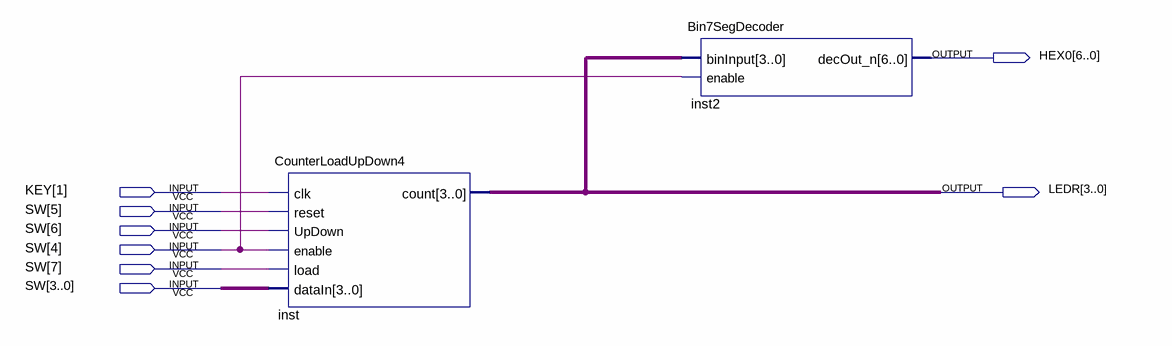
[diagram p0: schematic sheet]
// Quartus schematic CounterLoadUpDown4_bloc.bdf as structural Verilog: 2 symbols, 8 pins
module CounterLoadUpDown4_bloc (
  input  [1:1] KEY,
  input  [7:0] SW,
  output [6:0] HEX0,
  output [3:0] LEDR
);

  CounterLoadUpDown4 inst (
    .clk(KEY[1]), .reset(SW[5]), .UpDown(SW[6]), .enable(SW[4]), .load(SW[7]), .dataIn(SW[3:0]), .count(LEDR));
  Bin7SegDecoder inst2 (.binInput(LEDR), .enable(SW[4]), .decOut_n(HEX0));
endmodule
